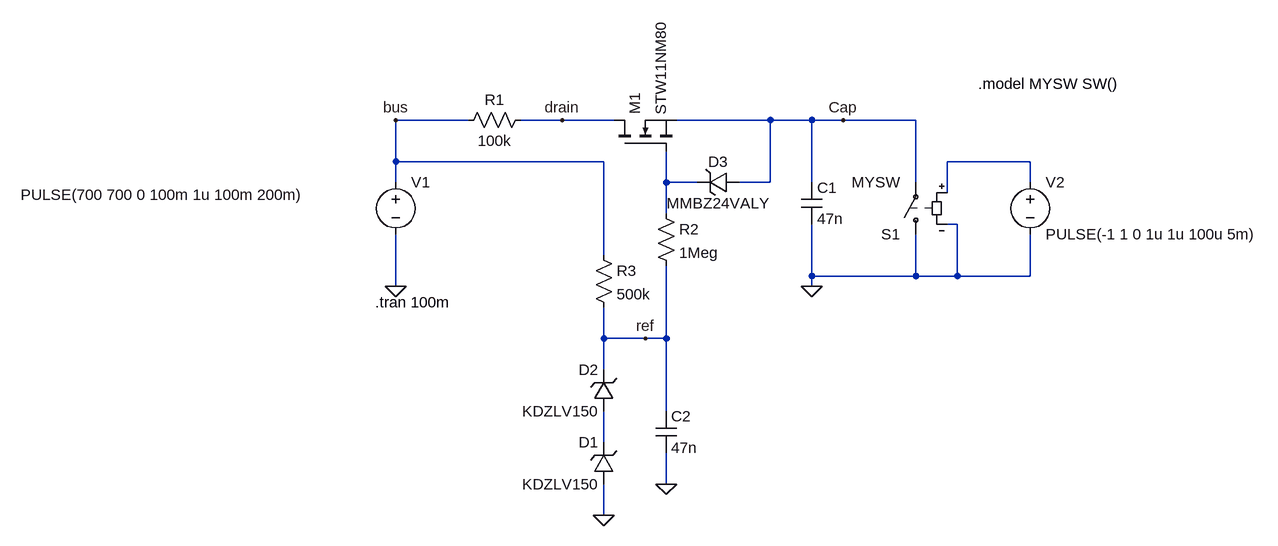
[diagram p0: schematic Pulse_gen_charge.asc]
Pulse_gen_charge.asc, the LTspice schematic file:
Version 4
SHEET 1 1656 680
WIRE 176 -64 64 -64
WIRE 320 -64 256 -64
WIRE 400 -64 320 -64
WIRE 640 -64 496 -64
WIRE 704 -64 640 -64
WIRE 752 -64 704 -64
WIRE 864 -64 752 -64
WIRE 64 0 64 -64
WIRE 384 0 64 0
WIRE 1040 0 912 0
WIRE 64 32 64 0
WIRE 480 32 480 -16
WIRE 528 32 480 32
WIRE 640 32 640 -64
WIRE 640 32 592 32
WIRE 704 32 704 -64
WIRE 864 32 864 -64
WIRE 1040 32 1040 0
WIRE 912 48 912 0
WIRE 480 80 480 32
WIRE 928 96 912 96
WIRE 384 144 384 0
WIRE 704 176 704 96
WIRE 864 176 864 112
WIRE 864 176 704 176
WIRE 928 176 928 96
WIRE 928 176 864 176
WIRE 1040 176 1040 112
WIRE 1040 176 928 176
WIRE 64 192 64 112
WIRE 704 192 704 176
WIRE 384 272 384 224
WIRE 448 272 384 272
WIRE 480 272 480 160
WIRE 480 272 448 272
WIRE 384 320 384 272
WIRE 480 384 480 272
WIRE 384 432 384 384
WIRE 480 496 480 448
WIRE 384 544 384 496
FLAG 64 192 0
FLAG 704 192 0
FLAG 752 -64 Cap
FLAG 384 544 0
FLAG 320 -64 drain
FLAG 64 -64 bus
FLAG 480 496 0
FLAG 448 272 ref
SYMBOL voltage 64 16 R0
WINDOW 123 0 0 Left 0
WINDOW 39 0 0 Left 0
WINDOW 3 -577 35 Left 2
SYMATTR InstName V1
SYMATTR Value PULSE(700 700 0 100m 1u 100m 200m)
SYMBOL res 160 -48 R270
WINDOW 0 32 56 VTop 2
WINDOW 3 0 56 VBottom 2
SYMATTR InstName R1
SYMATTR Value 100k
SYMBOL cap 688 32 R0
SYMATTR InstName C1
SYMATTR Value 47n
SYMBOL sw 864 128 R180
SYMATTR InstName S1
SYMATTR Value MYSW
SYMBOL voltage 1040 16 R0
WINDOW 123 0 0 Left 0
WINDOW 39 0 0 Left 0
SYMATTR InstName V2
SYMATTR Value PULSE(-1 1 0 1u 1u 100u 5m)
SYMBOL nmos 400 -16 R270
SYMATTR InstName M1
SYMATTR Value STW11NM80
SYMBOL zener 400 496 R180
WINDOW 0 24 64 Left 2
WINDOW 3 24 0 Left 2
SYMATTR InstName D1
SYMATTR Value KDZLV150
SYMATTR Description Diode
SYMATTR Type diode
SYMBOL zener 400 384 R180
WINDOW 0 24 64 Left 2
WINDOW 3 24 0 Left 2
SYMATTR InstName D2
SYMATTR Value KDZLV150
SYMATTR Description Diode
SYMATTR Type diode
SYMBOL cap 464 384 R0
SYMATTR InstName C2
SYMATTR Value 47n
SYMBOL res 464 64 R0
SYMATTR InstName R2
SYMATTR Value 1Meg
SYMBOL zener 592 16 R90
WINDOW 0 0 32 VBottom 2
WINDOW 3 32 32 VTop 2
SYMATTR InstName D3
SYMATTR Value MMBZ24VALY
SYMATTR Description Diode
SYMATTR Type diode
SYMBOL res 368 128 R0
SYMATTR InstName R3
SYMATTR Value 500k
TEXT 960 -120 Left 2 !.model MYSW SW()
TEXT 32 216 Left 2 !.tran 100m

The netlist it stands for:
* Pulse_gen_charge.asc
V1 bus 0 PULSE(700 700 0 100m 1u 100m 200m)
R1 bus drain 100k
C1 Cap 0 47n
S1 0 Cap N001 0 MYSW
V2 N001 0 PULSE(-1 1 0 1u 1u 100u 5m)
M1 drain N002 Cap Cap STW11NM80
D1 0 N003 KDZLV150
D2 N003 ref KDZLV150
C2 ref 0 47n
R2 N002 ref 1Meg
D3 Cap N002 MMBZ24VALY
R3 bus ref 500k
.model D D
.lib standard.dio
.model NMOS NMOS
.model PMOS PMOS
.lib standard.mos
.model MYSW SW()
.tran 100m
.backanno
.end